# EAGLE schematic woodenHaptics_v_0_4 (EAGLE 6.5.0)
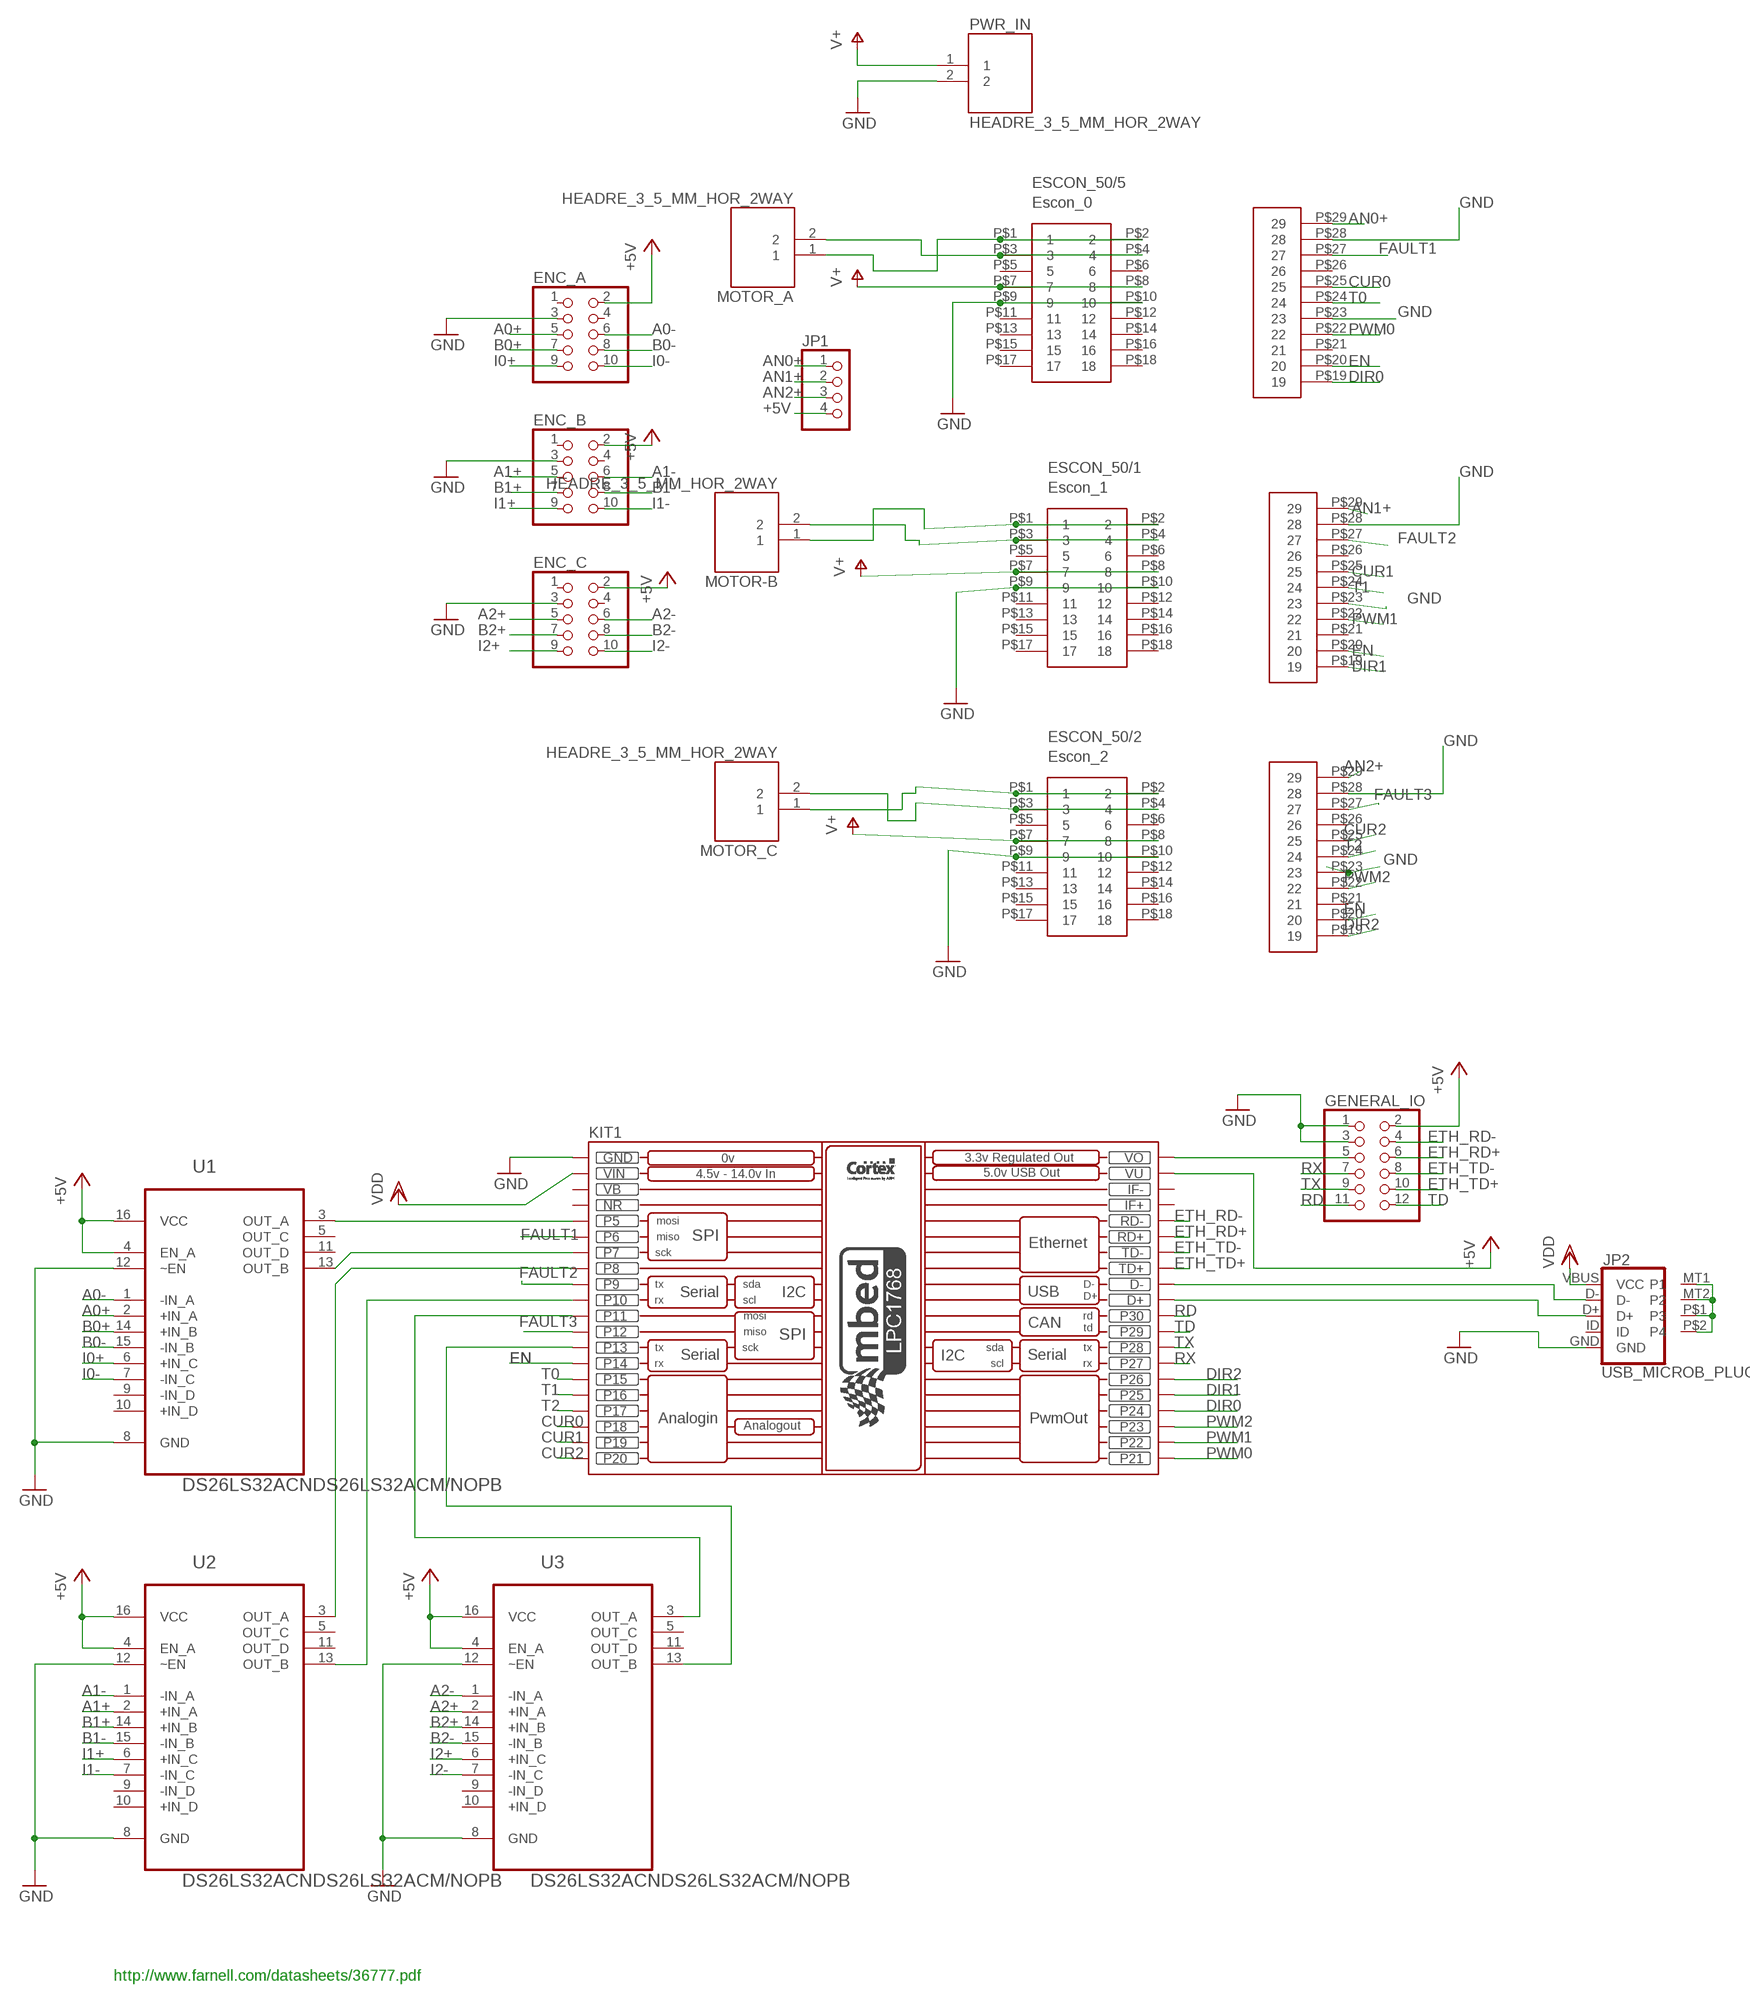
[diagram p0: schematic, sheet 1]

## Parts
ENC_A  PINHD-2X5  [2X05]
ENC_B  PINHD-2X5  [2X05]
ENC_C  PINHD-2X5  [2X05]
ESCON_50/1  Escon_1  ESCON_MODULE_50/5  [MODULE]
ESCON_50/2  Escon_2  ESCON_MODULE_50/5  [MODULE]
ESCON_50/5  Escon_0  ESCON_MODULE_50/5  [MODULE]
GENERAL_IO  PINHD-2X6  [2X06]
JP1  PINHD-1X4  [1X04]
JP2  USB_MICROB_PLUG  [USB-MICROB]
KIT1  MBED_NXP_LPC1768  [MBED-KIT]
MOTOR-B  HEADRE_3_5_MM_HOR_2WAY  [HEADER_3_5MM_HOR_2WAY]
MOTOR_A  HEADRE_3_5_MM_HOR_2WAY  [HEADER_3_5MM_HOR_2WAY]
MOTOR_C  HEADRE_3_5_MM_HOR_2WAY  [HEADER_3_5MM_HOR_2WAY]
PWR_IN  HEADRE_3_5_MM_HOR_2WAY  [HEADER_3_5MM_HOR_2WAY]
U1  DS26LS32ACNDS26LS32ACM/NOPB  [M16]
U2  DS26LS32ACNDS26LS32ACM/NOPB  [M16]
U3  DS26LS32ACNDS26LS32ACM/NOPB  [M16]

## Nets
+5V: ENC_A.2 ENC_B.2 ENC_C.2 GENERAL_IO.2 JP1.4 KIT1.VU U1.4(EN_A) U1.16(VCC) U2.4(EN_A) U2.16(VCC) U3.4(EN_A) U3.16(VCC)
A0+: ENC_A.5 U1.2(+IN_A)
A0-: ENC_A.6 U1.1(-IN_A)
A1+: ENC_B.5 U2.2(+IN_A)
A1-: ENC_B.6 U2.1(-IN_A)
A2+: ENC_C.5 U3.2(+IN_A)
A2-: ENC_C.6 U3.1(-IN_A)
AN0+: ESCON_50/5.P$29 JP1.1
AN1+: ESCON_50/1.P$29 JP1.2
AN2+: ESCON_50/2.P$29 JP1.3
B0+: ENC_A.7 U1.14(+IN_B)
B0-: ENC_A.8 U1.15(-IN_B)
B1+: ENC_B.7 U2.14(+IN_B)
B1-: ENC_B.8 U2.15(-IN_B)
B2+: ENC_C.7 U3.14(+IN_B)
B2-: ENC_C.8 U3.15(-IN_B)
CUR0: ESCON_50/5.P$25 KIT1.P$18(P18)
CUR1: ESCON_50/1.P$25 KIT1.P$19(P19)
CUR2: ESCON_50/2.P$25 KIT1.P$20(P20)
DIR0: ESCON_50/5.P$19 KIT1.P$24(P24)
DIR1: ESCON_50/1.P$19 KIT1.P$25(P25)
DIR2: ESCON_50/2.P$19 KIT1.P$26(P26)
EN: ESCON_50/1.P$20 ESCON_50/2.P$20 ESCON_50/5.P$20 KIT1.P$14(P14)
ETH_RD+: GENERAL_IO.6 KIT1.RD+
ETH_RD-: GENERAL_IO.4 KIT1.RD-
ETH_TD+: GENERAL_IO.10 KIT1.TD+
ETH_TD-: GENERAL_IO.8 KIT1.TD-
FAULT1: ESCON_50/5.P$27 KIT1.P$6(P6)
FAULT2: ESCON_50/1.P$27 KIT1.P$9(P9)
FAULT3: ESCON_50/2.P$27 KIT1.P$12(P12)
GND: ENC_A.3 ENC_B.3 ENC_C.3 ESCON_50/1.P$9 ESCON_50/1.P$10 ESCON_50/1.P$23 ESCON_50/1.P$28 ESCON_50/2.P$9 ESCON_50/2.P$10 ESCON_50/2.P$23 ESCON_50/2.P$28 ESCON_50/5.P$9 ESCON_50/5.P$10 ESCON_50/5.P$23 ESCON_50/5.P$28 GENERAL_IO.1 GENERAL_IO.3 JP2.GND KIT1.GND PWR_IN.2 U1.8(GND) U1.12(~EN) U2.8(GND) U2.12(~EN) U3.8(GND) U3.12(~EN)
I0+: ENC_A.9 U1.6(+IN_C)
I0-: ENC_A.10 U1.7(-IN_C)
I1+: ENC_B.9 U2.6(+IN_C)
I1-: ENC_B.10 U2.7(-IN_C)
I2+: ENC_C.9 U3.6(+IN_C)
I2-: ENC_C.10 U3.7(-IN_C)
MT: JP2.MT1(P1) JP2.MT2(P2) JP2.P$1(P3) JP2.P$2(P4)
N$1: ESCON_50/5.P$3 ESCON_50/5.P$4 MOTOR_A.2
N$2: ESCON_50/1.P$1 ESCON_50/1.P$2 MOTOR-B.1
N$3: JP2.D- KIT1.D-
N$4: ESCON_50/1.P$3 ESCON_50/1.P$4 MOTOR-B.2
N$5: ESCON_50/2.P$1 ESCON_50/2.P$2 MOTOR_C.1
N$6: ESCON_50/2.P$3 ESCON_50/2.P$4 MOTOR_C.2
N$7: JP2.D+ KIT1.D+
N$9: KIT1.P$8(P8) U2.3(OUT_A)
N$10: GENERAL_IO.5 KIT1.VOUT(VO)
N$11: KIT1.P$5(P5) U1.3(OUT_A)
N$13: KIT1.P$7(P7) U1.13(OUT_B)
N$15: KIT1.P$10(P10) U2.13(OUT_B)
N$16: KIT1.P$11(P11) U3.3(OUT_A)
N$18: KIT1.P$13(P13) U3.13(OUT_B)
N$19: ESCON_50/5.P$1 ESCON_50/5.P$2 MOTOR_A.1
PWM0: ESCON_50/5.P$22 KIT1.P$21(P21)
PWM1: ESCON_50/1.P$22 KIT1.P$22(P22)
PWM2: ESCON_50/2.P$22 KIT1.P$23(P23)
RD: GENERAL_IO.11 KIT1.P$30(P30)
RX: GENERAL_IO.7 KIT1.P$27(P27)
T0: ESCON_50/5.P$24 KIT1.P$15(P15)
T1: ESCON_50/1.P$24 KIT1.P$16(P16)
T2: ESCON_50/2.P$24 KIT1.P$17(P17)
TD: GENERAL_IO.12 KIT1.P$29(P29)
TX: GENERAL_IO.9 KIT1.P$28(P28)
V+: ESCON_50/1.P$7 ESCON_50/1.P$8 ESCON_50/2.P$7 ESCON_50/2.P$8 ESCON_50/5.P$7 ESCON_50/5.P$8 PWR_IN.1
VDD: JP2.VBUS(VCC) KIT1.VIN
Unconnected: ENC_A.1 ENC_A.4 ENC_B.1 ENC_B.4 ENC_C.1 ENC_C.4 ESCON_50/1.P$5 ESCON_50/1.P$6 ESCON_50/1.P$11 ESCON_50/1.P$12 ESCON_50/1.P$13 ESCON_50/1.P$14 ESCON_50/1.P$15 ESCON_50/1.P$16 ESCON_50/1.P$17 ESCON_50/1.P$18 ESCON_50/1.P$21 ESCON_50/1.P$26 ESCON_50/2.P$5 ESCON_50/2.P$6 ESCON_50/2.P$11 ESCON_50/2.P$12 ESCON_50/2.P$13 ESCON_50/2.P$14 ESCON_50/2.P$15 ESCON_50/2.P$16 ESCON_50/2.P$17 ESCON_50/2.P$18 ESCON_50/2.P$21 ESCON_50/2.P$26 ESCON_50/5.P$5 ESCON_50/5.P$6 ESCON_50/5.P$11 ESCON_50/5.P$12 ESCON_50/5.P$13 ESCON_50/5.P$14 ESCON_50/5.P$15 ESCON_50/5.P$16 ESCON_50/5.P$17 ESCON_50/5.P$18 ESCON_50/5.P$21 ESCON_50/5.P$26 JP2.ID KIT1.IF+ KIT1.IF- U1.5(OUT_C) U1.9(-IN_D) U1.10(+IN_D) U1.11(OUT_D) U2.5(OUT_C) U2.9(-IN_D) U2.10(+IN_D) U2.11(OUT_D) U3.5(OUT_C) U3.9(-IN_D) U3.10(+IN_D) U3.11(OUT_D)

## Notes on the sheet
- http://www.farnell.com/datasheets/36777.pdf

## Power pins joined to a net without a drawn wire
NR: KIT1.NR
VB: KIT1.VB

## Library data of the parts
ENC_A ENC_B ENC_C = pinhead:PINHD-2X5: PIN HEADER
ESCON_50/1 ESCON_50/2 ESCON_50/5 = Maxon-Motor:ESCON_MODULE_50/5
GENERAL_IO = pinhead:PINHD-2X6: PIN HEADER
JP1 = pinhead:PINHD-1X4: PIN HEADER
JP2 = SparkFun-Connectors:USB_MICROB_PLUG: USB Micro-B Plug Comes in a variety of packages. Check out Hirose's ZX-x0 line: http://www.hirose.co.jp/cataloge_hp/e24200011.pdf
KIT1 = MBED_v2.1:MBED_NXP_LPC1768: Mbed LPC1768 - ARM CORTEX v2.1 * Schematic symbol is now placed in eagles's default raster. *The pads diameter are suitable for routing between mbed pins * mbed pads are 0.8 mm drill diameter. --------------------------------------------- Created by: Mohamed Yousry *Alexandria, Egypt *Email: mohamed.yousry@ieeegoldegypt.org
MOTOR-B MOTOR_A MOTOR_C PWR_IN = header_3_5_MM_HOR_2WAY:HEADRE_3_5_MM_HOR_2WAY
U1-U3 = DSL26LS32ACN:DS26LS32ACN: Receiver